# Altium project ADA2.PrjPcb
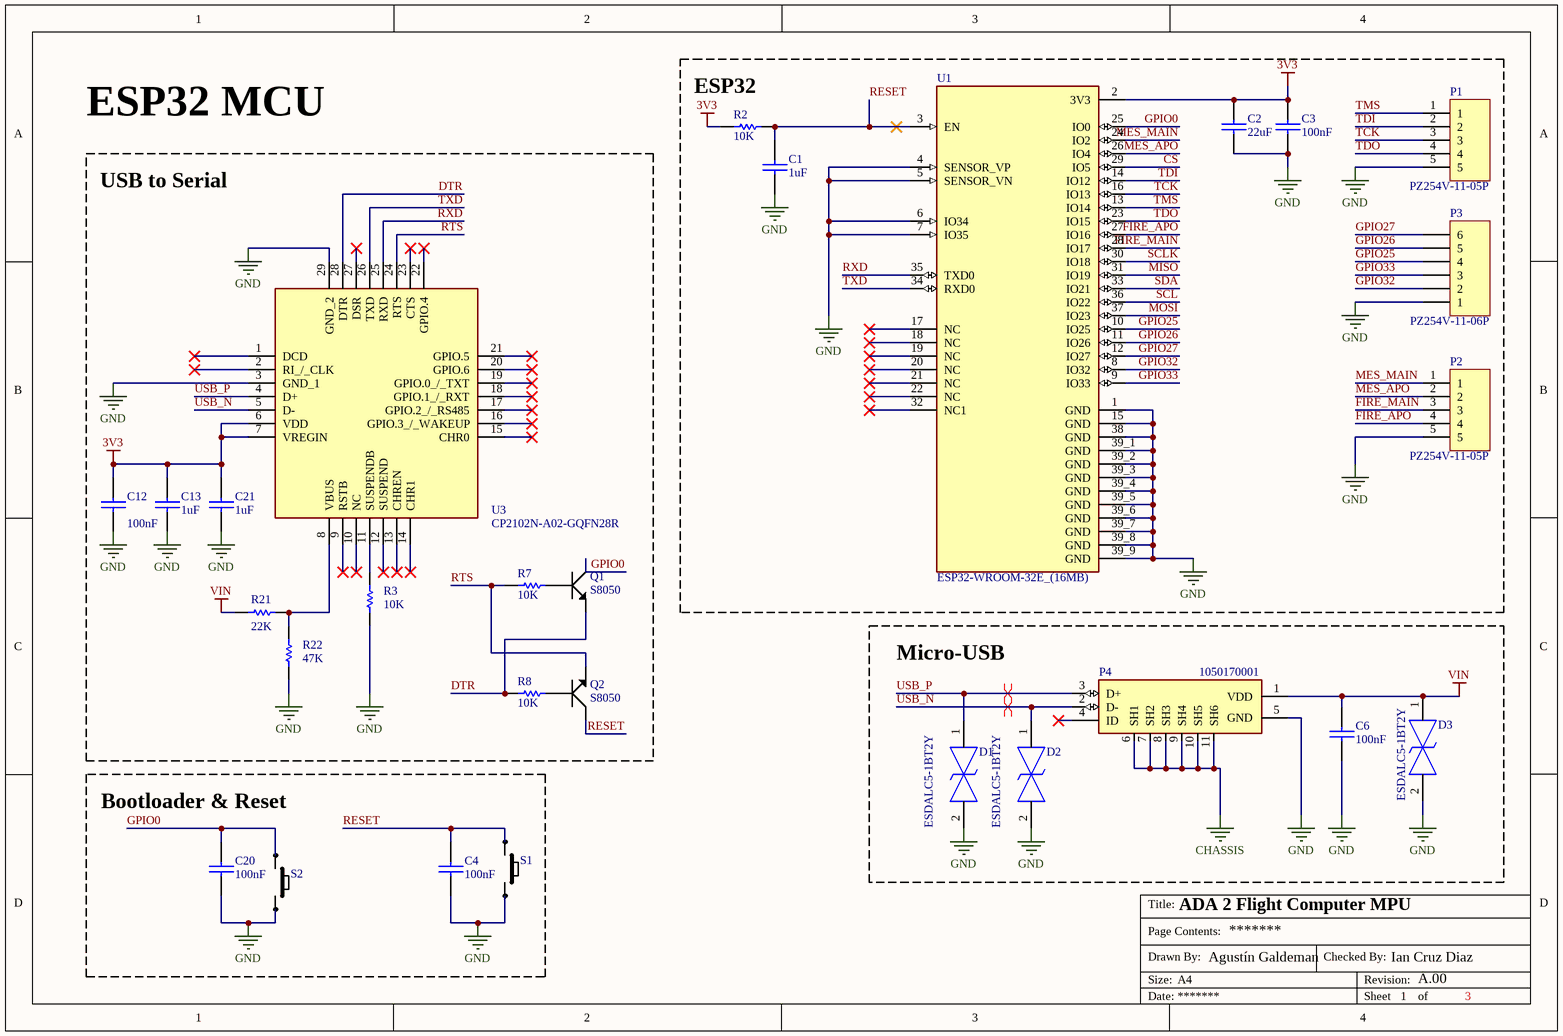
[diagram p0: ESP32 MCU.SchDoc]
pcb_author: Agustín Galdeman; pcb_name: ADA 2 Flight Computer MPU; pcb_rev: A.00; pcb_reviewer: Ian Cruz Diaz; TotalSheet: 3
3 sheets, 80 parts. Net scope: global (net labels, ports and power ports of the same name join across sheets).
Board file: ADA2PCB.PcbDoc
Sheets:
  ESP32 MCU.SchDoc
  ESP32 perifericos.SchDoc
  Mounting.SchDoc

## Sheet ESP32 MCU.SchDoc: Title
size A4; Date: *******; ApprovedBy: *******; CheckedBy: None; Author: *******; CompanyName: *******; DrawnBy: Name; Engineer: *******; Organization: *******; Address1: *******; Address2: *******; Address3: *******; Address4: *******; DocumentNumber: 1; Revision: *******; SheetNumber: 1; SheetTotal: 3; CurrentTime: *******; CurrentDate: *******; Time: *******; DocumentFullPathAndName: *******; DocumentName: *******; ModifiedDate: *******; ImagePath: *******; ProjectName: *******; Application_BuildNumber: *******

### Parts
C1  value 1uF  [CAPSMD0805]
C2  value 22uF  [CAPSMD0805]
C3  value 100nF  [CAPSMD0805]
C4  value 100nF  [CAPSMD0805]
C6  value 100nF  [CAPSMD0805]
C12  value 100nF  [CAPSMD0805]
C13  value 1uF  [CAPSMD0805]
C20  value 100nF  [CAPSMD0805]
C21  value 1uF  [CAPSMD0805]
D1  Manufacturer Part Number: ESDALC5-1BT2Y  [ESDALC51BT2]
D2  Manufacturer Part Number: ESDALC5-1BT2Y  [ESDALC51BT2]
D3  Manufacturer Part Number: ESDALC5-1BT2Y  [ESDALC51BT2]
P1  HEADER-5P-SR  [PZ254V-11-05P]  (value not drawn)
P2  HEADER-5P-SR  [PZ254V-11-05P]  (value not drawn)
P3  Manufacturer Part Number: PZ254V-11-06P  [HDR1X6]
P4  Manufacturer Part Number: 1050170001  [Micro-B Molex 1051640001]
Q1  S8050  [SOT-23-3]
Q2  S8050  [SOT-23-3]
R2  value 10K  [0805]
R3  value 10K  [0805]
R7  value 10K  [0805]
R8  value 10K  [0805]
R21  value 22K  [0805]
R22  value 47K  [0805]
S1  RESET  [PUSHBUTTON_2]  (value not drawn)
S2  BOOT  [PUSHBUTTON_2]  (value not drawn)
U1  ESP32-WROOM-32E_(16MB)  [XCVR_ESP32-WROOM-32E_(16MB)]
U3  (no value)  [CP2102N]

### Blocks framed on the sheet
ESP32: C1-C3 P1-P3 R2 U1
USB to Serial: C12 C13 C21 Q1 Q2 R3 R7 R8 R21 R22 U3
Micro-USB: C6 D1-D3 P4
Bootloader & Reset: C4 C20 S1 S2

### Nets
3V3: C2.1 C3.2 C12.2 C13.1 C21.1 R2.1 U1.2(3V3) U3.6(VDD) U3.7(VREGIN)
CHASSIS: P4.6(SH1) P4.7(SH2) P4.8(SH3) P4.9(SH4) P4.10(SH5) P4.11(SH6)
GND: C1.2 C2.2 C3.1 C4.1 C6.1 C12.1 C13.2 C20.1 C21.2 D1.2 D2.2 D3.2 P1.5 P2.5 P3.1 P4.5(GND) R3.2 R22.1 S1.2 S2.2 U1.1(GND) U1.4(SENSOR_VP) U1.5(SENSOR_VN) U1.6(IO34) U1.7(IO35) U1.15(GND) U1.38(GND) U1.39_1(GND) U1.39_2(GND) U1.39_3(GND) U1.39_4(GND) U1.39_5(GND) U1.39_6(GND) U1.39_7(GND) U1.39_8(GND) U1.39_9(GND) U3.3(GND_1) U3.29(GND_2)
VIN: C6.2 D3.1 P4.1(VDD) R21.1
CS: U1.29(IO5)
DTR: Q1.2 R8.1 U3.28(DTR)
FIRE_APO: P2.4 U1.27(IO16)
FIRE_MAIN: P2.3 U1.28(IO17)
GPIO0: C20.2 Q1.3 S2.1 U1.25(IO0)
GPIO25: P3.4 U1.10(IO25)
GPIO26: P3.5 U1.11(IO26)
GPIO27: P3.6 U1.12(IO27)
GPIO32: P3.2 U1.8(IO32)
GPIO33: P3.3 U1.9(IO33)
MES_APO: P2.2 U1.26(IO4)
MES_MAIN: P2.1 U1.24(IO2)
MISO: U1.31(IO19)
MOSI: U1.37(IO23)
RESET: C1.1 C4.2 Q2.3 R2.2 S1.1 U1.3(EN)
RTS: Q2.2 R7.1 U3.24(RTS)
RXD: U1.35(TXD0) U3.25(RXD)
SCL: U1.36(IO22)
SCLK: U1.30(IO18)
SDA: U1.33(IO21)
TCK: P1.3 U1.16(IO13)
TDI: P1.2 U1.14(IO12)
TDO: P1.4 U1.23(IO15)
TMS: P1.1 U1.13(IO14)
TXD: U1.34(RXD0) U3.26(TXD)
USB_N: D2.1 P4.2(D-) U3.5(D-)
USB_P: D1.1 P4.3(D+) U3.4(D+)
NetQ1_1: Q1.1 R7.2
NetQ2_1: Q2.1 R8.2
NetR3_1: R3.1 U3.11(SUSPENDB)
NetR21_2: R21.2 R22.2 U3.8(VBUS)

Not connected (* = marked no-connect by the designer): P4 4(ID)*; U1 17(NC)* 18(NC)* 19(NC)* 20(NC)* 21(NC)* 22(NC)* 32(NC1)*; U3 1(DCD)* 2(RI_/_CLK)* 9(RSTB)* 10(NC)* 12(SUSPEND)* 13(CHREN)* 14(CHR1)* 15(CHR0)* 16(GPIO.3_/_WAKEUP)* 17(GPIO.2_/_RS485)* 18(GPIO.1_/_RXT)* 19(GPIO.0_/_TXT)* 20(GPIO.6)* 21(GPIO.5)* 22(GPIO.4)* 23(CTS)* 27(DSR)*

### Layout directives
differential pair; differential pair class USB: USB_N, USB_P

### Notes on the sheet
- ESP32 MCU
- Title:
- Size:
- Date:
- Drawn By:
- Page Contents:
- A4
- Checked By:
- Revision:
- Sheet
- of

### Library data of the parts
C1 C13 C21 = CAP: Capacitor SMD 4.7nF; Manufacturer: FH (Guangdong Fenghua Advanced Tech); Manufacturer Part Number: 0805F105Z250NT; Supplier: JLCPCB; Supplier Part Number: C285184
C2 = CAP: Capacitor SMD 4.7nF; Manufacturer: Samsung Electro-Mechanics; Manufacturer Part Number: CL21A226KPCLRNC; Supplier: JLCPCB; Supplier Part Number: C318688
C3 C4 C6 C12 C20 = CAP: Capacitor SMD 4.7nF; Manufacturer: FH (Guangdong Fenghua Advanced Tech); Manufacturer Part Number: 0805B104M500NT; Supplier: JLCPCB; Supplier Part Number: C286511
D1-D3 = ESDALC5-1BT2: ESD Suppressors / TVS Diodes Single Line Transil Vbr 5V min 26pF 0; Manufacturer: STMicroelectronics; Supplier: JLCPCB; Supplier Part Number: C3712112
P1 P2 = HEADER-5P-SR: Straight Square Pins 2.5mm 6mm -40℃~+105℃ 3mm 5 2.54mm 单排 Black Brass 1x5P Plugin,P=2.54mm  Pin Headers ROHS; Manufacturer: XFCN; Supplier: JLCPCB; Supplier Part Number: C492404; Manufacturer Part Number: PZ254V-11-05P
P3 = Header 6: Header, 6-Pin; Manufacturer: XFCN; Supplier: JLCPCB; Supplier Part Number: C492405
P4 = Micro-B Molex 1051640001: USB - micro B USB 2.0 Receptacle Connector 5 Position Surface Mount, Right Angle; Through Hole; Manufacturer: MOLEX; Supplier: JLCPCB; Supplier Part Number: C136000
Q1 Q2 = S8050: 25V 300mW 500mA SOT-23  Bipolar Transistors - BJT ROHS; Manufacturer: JSMSEMI; Supplier: JLCPCB; Supplier Part Number: C916390; Manufacturer Part Number: S8050
R2 R3 R7 R8 = RES: Resistencia SMD 470ohms; Manufacturer: Viking Tech; Manufacturer Part Number: ARG05BTC1002; Supplier: JLCPCB; Supplier Part Number: C406725
R21 = RES: Resistencia SMD 470ohms; Manufacturer: KOA Speer Elec; Manufacturer Part Number: RN73H2ATTD2202B25; Supplier: JLCPCB; Supplier Part Number: C186285
R22 = RES: Resistencia SMD 470ohms; Manufacturer: Sunway; Manufacturer Part Number: SC0805J4702F4ANRH; Supplier: JLCPCB; Supplier Part Number: C3152235
S1 S2 = PUSHBUTTON_2: SWITCH TACTILE SPST-NO 0.05A 12V; Manufacturer: C&K; Manufacturer Part Number: PTS645SM43SMTR92LFS; Supplier: JLCPCB; Supplier Part Number: C221880; Parameter 2: *; Parameter 3: *; Parameter 4: *
U1 = ESP32-WROOM-32E_(16MB): Bluetooth, WiFi 802.11b/g/n, Bluetooth v4.2 +EDR, Class 1, 2 and 3 Transceiver Module 2.4GHz ~ 2.5GHz Integrated, Trace Surface Mount; Manufacturer: Espressif Systems; Manufacturer Part Number: ESP32-WROOM-32E-N16; Supplier: JLCPCB; Supplier Part Number: C701343
U3 = CP2102N-A02-GQFN28R: USB Interface IC USB to UART bridge - QFN28; Manufacturer: SILICON LABS; Manufacturer Part Number: CP2102N-A02-GQFN28R; Supplier: JLCPCB; Supplier Part Number: C964632

## Sheet ESP32 perifericos.SchDoc: Title
size A4; Date: *******; ApprovedBy: *******; CheckedBy: None; Author: *******; CompanyName: *******; DrawnBy: Name; Engineer: *******; Organization: *******; Address1: *******; Address2: *******; Address3: *******; Address4: *******; DocumentNumber: 2; Revision: *******; SheetNumber: 2; SheetTotal: 3; CurrentTime: *******; CurrentDate: *******; Time: *******; DocumentFullPathAndName: *******; DocumentName: *******; ModifiedDate: *******; ImagePath: *******; ProjectName: *******; Application_BuildNumber: *******
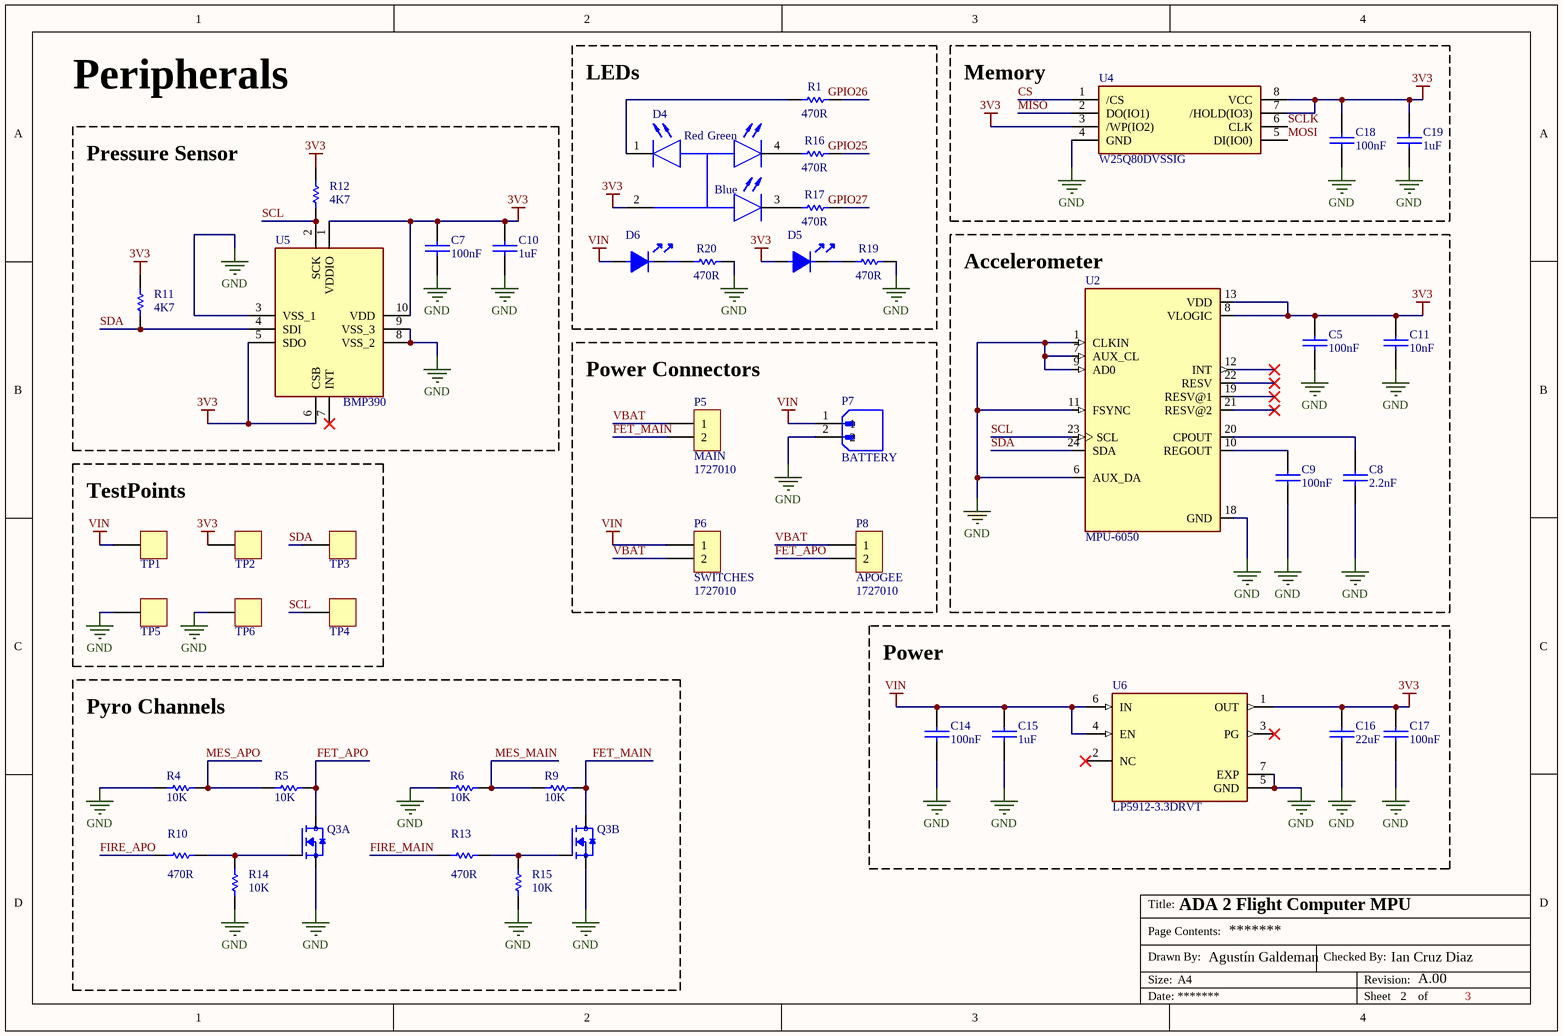
[diagram p1: ESP32 perifericos.SchDoc]

### Parts
C5  value 100nF  [CAPSMD0805]
C7  value 100nF  [CAPSMD0805]
C8  value 2.2nF  [CAPSMD0805]
C9  value 100nF  [CAPSMD0805]
C10  value 1uF  [CAPSMD0805]
C11  value 10nF  [CAPSMD0805]
C14  value 100nF  [CAPSMD0805]
C15  value 1uF  [CAPSMD0805]
C16  value 22uF  [CAPSMD0805]
C17  value 100nF  [CAPSMD0805]
C18  value 100nF  [CAPSMD0805]
C19  value 1uF  [CAPSMD0805]
D4  (no value)  [4-PLCC]
D5  (no value)  [LEDSMD0603]
D6  (no value)  [LEDSMD0603]
P5  MAIN  Manufacturer Part Number: 1727010  [BORNERA2]
P6  SWITCHES  Manufacturer Part Number: 1727010  [BORNERA2]
P7  BATTERY  [JST_BM02B-GHS-TBT(LF)(SN)]
P8  APOGEE  Manufacturer Part Number: 1727010  [BORNERA2]
Q3  (no value)  [TRANS_TSM200N03DPQ33_RGG]  (parts A,B of 2)
R1  value 470R  [0805]
R4  value 10K  [0805]
R5  value 10K  [0805]
R6  value 10K  [0805]
R9  value 10K  [0805]
R10  value 470R  [0805]
R11  value 4K7  [0805]
R12  value 4K7  [0805]
R13  value 470R  [0805]
R14  value 10K  [0805]
R15  value 10K  [0805]
R16  value 470R  [0805]
R17  value 470R  [0805]
R19  value 470R  [0805]
R20  value 470R  [0805]
TP1  VIN  [5015]  (value not drawn)
TP2  3V3  [5015]  (value not drawn)
TP3  SDA  [5015]  (value not drawn)
TP4  SCL  [5015]  (value not drawn)
TP5  GND  [5015]  (value not drawn)
TP6  GND  [5015]  (value not drawn)
U2  (no value)  [QFN24]
U4  (no value)  [SOIC127P790X216-8N]
U5  (no value)  [BMP390]
U6  (no value)  [SON65P200X200X80-7N]

### Blocks framed on the sheet
LEDs: D4-D6 R1 R16 R17 R19 R20
Memory: C18 C19 U4
Pressure Sensor: C7 C10 R11 R12 U5
Accelerometer: C5 C8 C9 C11 U2
Power Connectors: P5-P8
TestPoints: TP1-TP6
Power: C14-C17 U6
Pyro Channels: Q3 R4-R6 R9 R10 R13-R15

### Nets
3V3: C5.2 C7.2 C10.1 C11.1 C16.1 C17.2 C18.2 C19.1 D4.2(A) D5.A R11.2 R12.2 TP2.1 U2.8(VLOGIC) U2.13(VDD) U4.3(/WP(IO2)) U4.7(/HOLD(IO3)) U4.8(VCC) U5.1(VDDIO) U5.5(SDO) U5.6(CSB) U5.10(VDD) U6.1(OUT)
GND: C5.1 C7.1 C8.2 C9.1 C10.2 C11.2 C14.1 C15.2 C16.2 C17.1 C18.1 C19.2 P7.2 Q3.1(S1) Q3.3(S2) R4.1 R6.1 R14.2 R15.2 R19.2 R20.2 TP5.1 TP6.1 U2.1(CLKIN) U2.6(AUX_DA) U2.7(AUX_CL) U2.9(AD0) U2.11(FSYNC) U2.18(GND) U4.4(GND) U5.3(VSS_1) U5.8(VSS_2) U5.9(VSS_3) U6.5(GND) U6.7(EXP)
VIN: C14.2 C15.1 D6.A P6.1 P7.1 TP1.1 U6.4(EN) U6.6(IN)
CS: U4.1(/CS)
FET_APO: P8.2 Q3.7_8(D1) R5.2
FET_MAIN: P5.2 Q3.5_6(D2) R9.2
FIRE_APO: R10.1
FIRE_MAIN: R13.1
GPIO25: R16.2
GPIO26: R1.2
GPIO27: R17.2
MES_APO: R4.2 R5.1
MES_MAIN: R6.2 R9.1
MISO: U4.2(DO(IO1))
MOSI: U4.5(DI(IO0))
SCL: R12.1 TP4.1 U2.23(SCL) U5.2(SCK)
SCLK: U4.6(CLK)
SDA: R11.1 TP3.1 U2.24(SDA) U5.4(SDI)
VBAT: P5.1 P6.2 P8.1
NetC8_1: C8.1 U2.20(CPOUT)
NetC9_2: C9.2 U2.10(REGOUT)
NetD4_1: D4.1(RED_C) R1.1
NetD4_3: D4.3(BLUE_C) R17.1
NetD4_4: D4.4(GREEN_C) R16.1
NetD5_K: D5.K R19.1
NetD6_K: D6.K R20.1
NetQ3_2: Q3.2(G1) R10.2 R14.1
NetQ3_4: Q3.4(G2) R13.2 R15.1

Not connected (* = marked no-connect by the designer): U2 12(INT)* 19(RESV@1)* 21(RESV@2)* 22(RESV)*; U5 7(INT)*; U6 2(NC)* 3(PG)*

### Notes on the sheet
- Peripherals
- Title:
- Size:
- Date:
- Drawn By:
- Page Contents:
- A4
- Checked By:
- Revision:
- Sheet
- of
- (in symbol LED RGB) Red; Green; Blue

### Library data of the parts
C5 C7 C9 C14 C17 C18 = CAP: as C3 on sheet ESP32 MCU; Supplier: JLCPCB; Supplier Part Number: C286511
C8 = CAP: Capacitor SMD 4.7nF; Manufacturer: YAGEO; Manufacturer Part Number: CC0805JRX7R0BB222; Supplier: JLCPCB; Supplier Part Number: C527219
C10 C15 C19 = CAP: as C1 on sheet ESP32 MCU; Supplier: JLCPCB; Supplier Part Number: C285184
C11 = CAP: Capacitor SMD 4.7nF; Manufacturer: PSA(Prosperity Dielectrics); Manufacturer Part Number: FN21X103K500PXG; Supplier: JLCPCB; Supplier Part Number: C525298
C16 = CAP: as C2 on sheet ESP32 MCU; Supplier: JLCPCB; Supplier Part Number: C318688
D4 = LED RGB: Red, Green, Blue _RGB_ 622nm Red, 530nm Green, 470nm Blue LED Indication - Discrete 1.9V Red, 3V Green, 3V Blue 4-PLCC; Manufacturer: CREELED, INC.; Manufacturer Part Number: CLVBA-FKA-CAEDH8BBB7A363; Supplier: JLCPCB; Supplier Part Number: C5250259
D5 D6 = LED: LED SMD Verde; Manufacturer: Everlight Elec; Manufacturer Part Number: 19-217/R6C-AL1M2VY/3T; Supplier: JLCPCB; Supplier Part Number: C72044
P5 P6 P8 = BORNERA 2: 13.5A 200V Green Straight pin 3.81mm 1 2 Plugin,P=3.81mm  Screw terminal ROHS; Manufacturer: Phoenix Contact; Supplier: JLCPCB; Supplier Part Number: C89123
P7 = BM02B-GHS-TBT(LF)(SN): Connector Header Surface Mount 2 position 0.049 (1.25mm); Manufacturer: JST Sales America; Manufacturer Part Number: BM02B-GHS-TBT(LF)(SN); Supplier: JLCPCB; Supplier Part Number: C161690
Q3 = TSM200N03DPQ33_RGG: MOSFET 2 N-CH 30V 20A 8PDFN; Manufacturer: Taiwan Semiconductor Corporation; Manufacturer Part Number: TSM200N03DPQ33 RGG; Supplier: Digikey; Supplier Part Number: TSM200N03DPQ33RGGCT-ND
R1 R10 R13 R16 R17 R19 R20 = RES: Resistencia SMD 470ohms; Manufacturer: UNI-ROYAL(Uniroyal Elec); Manufacturer Part Number: CQ05W8J0471T5E; Supplier: JLCPCB; Supplier Part Number: C473621
R4-R6 R9 R14 R15 = RES: as R2 on sheet ESP32 MCU; Supplier: JLCPCB; Supplier Part Number: C406725
R11 R12 = RES: Resistencia SMD 470ohms; Manufacturer: Viking Tech; Manufacturer Part Number: CR-05FL7---4K7; Supplier: JLCPCB; Supplier Part Number: C280006
TP1-TP6 = TESTPOINT_5015: Thimble/Copper Rod/Test Ring ROHS; Manufacturer: Ronghe; Manufacturer Part Number: RH-5015; Supplier: JLCPCB; Supplier Part Number: C5199798
U2 = MPU-6050: MPU-6050 series Accelerometer, Gyroscope, 3 Axis Sensor Evaluation Board; Manufacturer: TDK InvenSense; Manufacturer Part Number: MPU-6050; Supplier: JLCPCB; Supplier Part Number: C24112
U4 = W25Q80DVSSIG: 8M-bit 3.0V Serial Flash Memory with uniform 4KB sectors and Dual/Quad SPI; Manufacturer: Winbond Elec; Manufacturer Part Number: W25Q80DVSSIG; Supplier: JLCPCB; Supplier Part Number: C14086
U5 = BMP390: Board Mount Pressure Sensors; Manufacturer: BOSCH; Manufacturer Part Number: BMP390; Supplier: JLCPCB; Supplier Part Number: C5124834
U6 = LP5912-3.3DRVT: 500-mA, low-noise, low-IQ, low-dropout voltage regulator with reverse current protection 6-WSON -40 to 125; Manufacturer: Texas Instruments; Manufacturer Part Number: LP5912-3.3DRVT; Supplier: JLCPCB; Supplier Part Number: C134121

## Sheet Mounting.SchDoc: Title
size A4; Date: *******; ApprovedBy: *******; CheckedBy: None; Author: *******; CompanyName: *******; DrawnBy: Name; Engineer: *******; Organization: *******; Address1: *******; Address2: *******; Address3: *******; Address4: *******; DocumentNumber: 3; Revision: *******; SheetNumber: 3; SheetTotal: 3; CurrentTime: *******; CurrentDate: *******; Time: *******; DocumentFullPathAndName: *******; DocumentName: *******; ModifiedDate: *******; ImagePath: *******; ProjectName: *******; Application_BuildNumber: *******
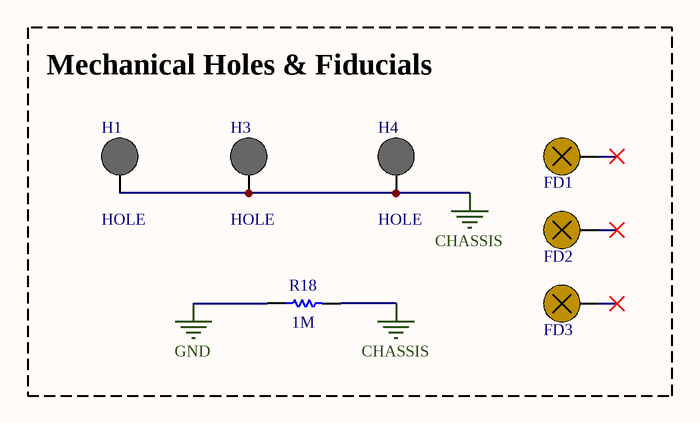
[diagram p2: Mounting.SchDoc]

### Parts
FD1  FIDUCIAL  [FIDUCIAL]  (value not drawn)  (no BOM)
FD2  FIDUCIAL  [FIDUCIAL]  (value not drawn)  (no BOM)
FD3  FIDUCIAL  [FIDUCIAL]  (value not drawn)  (no BOM)
H1  HOLE  [HOLE_M3]  (no BOM)
H3  HOLE  [HOLE_M3]  (no BOM)
H4  HOLE  [HOLE_M3]  (no BOM)
R18  value 1M  [0805]

### Blocks framed on the sheet
Mechanical Holes & Fiducials: FD1-FD3 H1 H3 H4 R18

### Nets
CHASSIS: H1.1 H3.1 H4.1 R18.2
GND: R18.1

Not connected (* = marked no-connect by the designer): FD1 1*; FD2 1*; FD3 1*

### Notes on the sheet
- Title:
- Size:
- Date:
- Drawn By:
- Page Contents:
- A4
- Checked By:
- Revision:
- Sheet
- of

### Library data of the parts
R18 = RES: Resistencia SMD 470ohms; Manufacturer: YAGEO; Manufacturer Part Number: RC0805FR-071ML; Supplier: JLCPCB; Supplier Part Number: C107700

## Nets that join several sheets
3V3: ESP32 MCU (9 pins), ESP32 perifericos (23 pins)
CHASSIS: ESP32 MCU (6 pins), Mounting (H1.1 H3.1 H4.1 R18.2)
GND: ESP32 MCU (38 pins), ESP32 perifericos (35 pins), Mounting (R18.1)
VIN: ESP32 MCU (C6.2 D3.1 P4.1 R21.1), ESP32 perifericos (8 pins)
CS: ESP32 MCU (U1.29), ESP32 perifericos (U4.1)
FIRE_APO: ESP32 MCU (P2.4 U1.27), ESP32 perifericos (R10.1)
FIRE_MAIN: ESP32 MCU (P2.3 U1.28), ESP32 perifericos (R13.1)
GPIO25: ESP32 MCU (P3.4 U1.10), ESP32 perifericos (R16.2)
GPIO26: ESP32 MCU (P3.5 U1.11), ESP32 perifericos (R1.2)
GPIO27: ESP32 MCU (P3.6 U1.12), ESP32 perifericos (R17.2)
MES_APO: ESP32 MCU (P2.2 U1.26), ESP32 perifericos (R4.2 R5.1)
MES_MAIN: ESP32 MCU (P2.1 U1.24), ESP32 perifericos (R6.2 R9.1)
MISO: ESP32 MCU (U1.31), ESP32 perifericos (U4.2)
MOSI: ESP32 MCU (U1.37), ESP32 perifericos (U4.5)
SCL: ESP32 MCU (U1.36), ESP32 perifericos (R12.1 TP4.1 U2.23 U5.2)
SCLK: ESP32 MCU (U1.30), ESP32 perifericos (U4.6)
SDA: ESP32 MCU (U1.33), ESP32 perifericos (R11.1 TP3.1 U2.24 U5.4)